# Altium schematic sheet capacitiveTouchcircuit.SchDoc
size A4
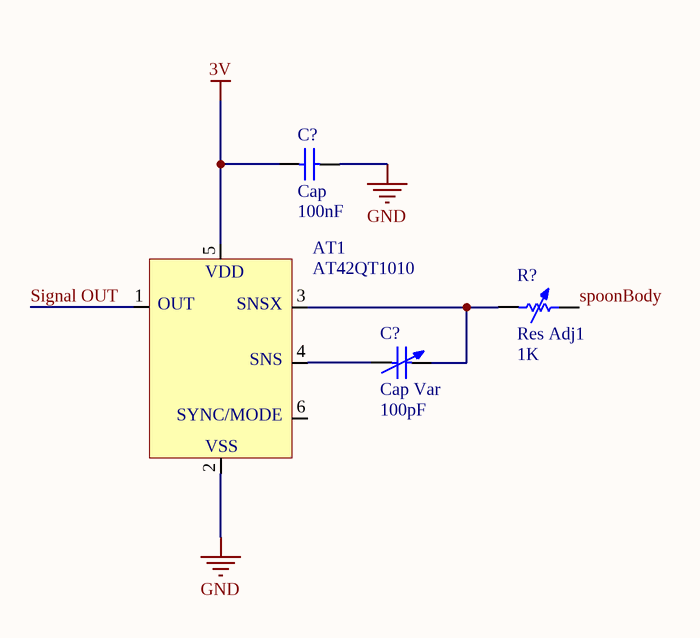
[diagram p0: capacitiveTouchcircuit.SchDoc]

## Parts
(Parts that share a designator on the sheet are numbered #1, #2 ... from top to bottom, then left to right.)
AT1  AT42QT1010
C?#1  Cap  value 100nF  [RAD-0.3]
C?#2  Cap Var  value 100pF  [C1210_N]
R?  Res Adj1  value 1K  [AXIAL-0.7]

## Nets
3V: AT1.5(VDD) C?#1.1
GND: AT1.2(VSS) C?#1.2
Signal OUT: AT1.1(OUT)
spoonBody: R?.2
NetAT1_3: AT1.3(SNSK) C?#2.2 R?.1
NetAT1_4: AT1.4(SNS) C?#2.1

Not connected (* = marked no-connect by the designer): AT1 6(SYNC/MODE)

## Notes on the sheet
- (in symbol AT42QT1010) SNSX

## Library data of the parts
C?#1 = Cap: Capacitor; Published: 8-Jun-2000; LatestRevisionDate: 17-Jul-2002; LatestRevisionNote: Re-released for DXP Platform.; PackageReference: RAD-0.3; Publisher: Altium Limited; PackageDescription: Radial Cap, Thru-Hole; 2 Leads; 0.3 in Pin Spacing
C?#2 = Cap Var: Variable or Adjustable Capacitor; Published: 24-Mar-1999; LatestRevisionDate: 29-May-2009; LatestRevisionNote: IPC-7351 Footprint Added.; PackageReference: C1210; Publisher: Altium Limited; PackageDescription: Chip Capacitor 1210 Case Size; Code_JEITA: 1210; Code_IPC: CAPC3225
R? = Res Adj1: Variable Resistor; Set Position: 0.5; Published: 8-Jun-2000; LatestRevisionDate: 17-Jul-2002; LatestRevisionNote: Re-released for DXP Platform.; PackageReference: AXIAL-0.7; Publisher: Altium Limited; PackageDescription: Axial Device, Thru-Hole; 2 Leads; 0.7 in Pin Spacing